# Altium schematic sheet [06] - IO_Ports.SchDoc
size A4
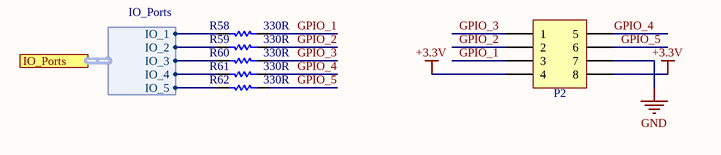
[diagram p0: [06] - IO_Ports.SchDoc]

## Parts
P2  Header 4X2A  [HDR2X4_CEN]  (value not drawn)
R58  Resistance: 330R  [Res-0603]  (hidden comment: Res1)
R59  Resistance: 330R  [Res-0603]  (hidden comment: Res1)
R60  Resistance: 330R  [Res-0603]  (hidden comment: Res1)
R61  Resistance: 330R  [Res-0603]  (hidden comment: Res1)
R62  Resistance: 330R  [Res-0603]  (hidden comment: Res1)

## Ports
IO_Ports (harness IO_Ports)

## Harnesses
IO_Ports: IO_1, IO_2, IO_3, IO_4, IO_5

## Nets
+3.3V: P2.4 P2.8
GND: P2.7
GPIO_1: P2.3 R58.2
GPIO_2: P2.2 R59.2
GPIO_3: P2.1 R60.2
GPIO_4: P2.5 R61.2
GPIO_5: P2.6 R62.2
NetR58_1: R58.1 ; port IO_Ports.IO_1
NetR59_1: R59.1 ; port IO_Ports.IO_2
NetR60_1: R60.1 ; port IO_Ports.IO_3
NetR61_1: R61.1 ; port IO_Ports.IO_4
NetR62_1: R62.1 ; port IO_Ports.IO_5

## Notes on the sheet
- Title
- Size:
- Date:
- A4
- Number:
- Time:
- Revision:
- Sheet
- of
- File:

## Library data of the parts
P2 = Header 4X2A: Header, 4-Pin, Dual row; LatestRevisionDate: 17-Jul-2002; LatestRevisionNote: Re-released for DXP Platform.; Publisher: Altium Limited
R58-R62 = 1: Chip Resistor; Manufacturer: Panasonic; Manufacturer Part Number: ERJ-3EKF3300V; Tolerance: 1%; Power Rating: 100mW; Voltage Rating (DC): 75V; Temperature Coefficient: 100ppm/°C; ComponentLink1URL: http://industrial.panasonic.com/www-cgi/jvcr13pz.cgi?E+PZ+3+AOA0002+ERJ6ENF3000V+7+WW; ComponentLink1Description: http://industrial.panasonic.com/www-cgi/jvcr13pz.cgi?E+PZ+3+AOA0002+ERJ6ENF3000V+7+WW; Supplier 1: Digi-Key; Supplier Part Number 1: P330HDKR-ND; Stock 1: 924496; Pricing 1: 1=0.1, 10=0.079, 100=0.0323, 1000=0.01449, 2500=0.01258 (USD); Mount: Surface Mount; Case/Package: 0603; Number of Pins: 2; Weight: 7.1E-05oz; Case Code (Imperial): 0603; Case Code (Metric): 1608; Contact Plating: Tin; Min Operating Temperature: -55°C; Max Operating Temperature: 155°C; Packaging: Tape and Reel; Voltage Rating: 75V; Package Quantity: 1; Composition: Thick Film; Termination: SMD/SMT; Number of Terminations: 2; Military Standard: Not; Max Power Dissipation: 100mW; Features: Automotive AEC-Q200; Length: 1.6mm; Height: 0.022inch; Width: 0.8mm; Depth: 0.8mm; Radiation Hardening: No; REACH SVHC: No SVHC; Lead Free: Lead Free; ComponentLink2URL: https://datasheet.ciiva.com/7886/aoa0000ce2-7886729.pdf; ComponentLink2Description: https://datasheet.ciiva.com/7886/aoa0000ce2-7886729.pdf; ComponentLink3URL: https://datasheet.ciiva.com/48531/aoa0000ce2-48531001.pdf; ComponentLink3Description: https://datasheet.ciiva.com/48531/aoa0000ce2-48531001.pdf; ComponentLink4URL: https://datasheet.ciiva.com/22721/426256-22721099.pdf; ComponentLink4Description: https://datasheet.ciiva.com/22721/426256-22721099.pdf; ComponentLink5URL: https://datasheet.ciiva.com/46373/1678782-46373899.pdf; ComponentLink5Description: https://datasheet.ciiva.com/46373/1678782-46373899.pdf; ComponentLink6URL: https://datasheet.ciiva.com/9117/aoa0000ce2-9117132.pdf; ComponentLink6Description: https://datasheet.ciiva.com/9117/aoa0000ce2-9117132.pdf; ComponentLink7URL: https://datasheet.ciiva.com/46373/1678782-46373900.pdf; ComponentLink7Description: https://datasheet.ciiva.com/46373/1678782-46373900.pdf